# Altium schematic sheet leo_DM_BUCK.SchDoc
size A; SheetNumber: 3; SheetTotal: 6
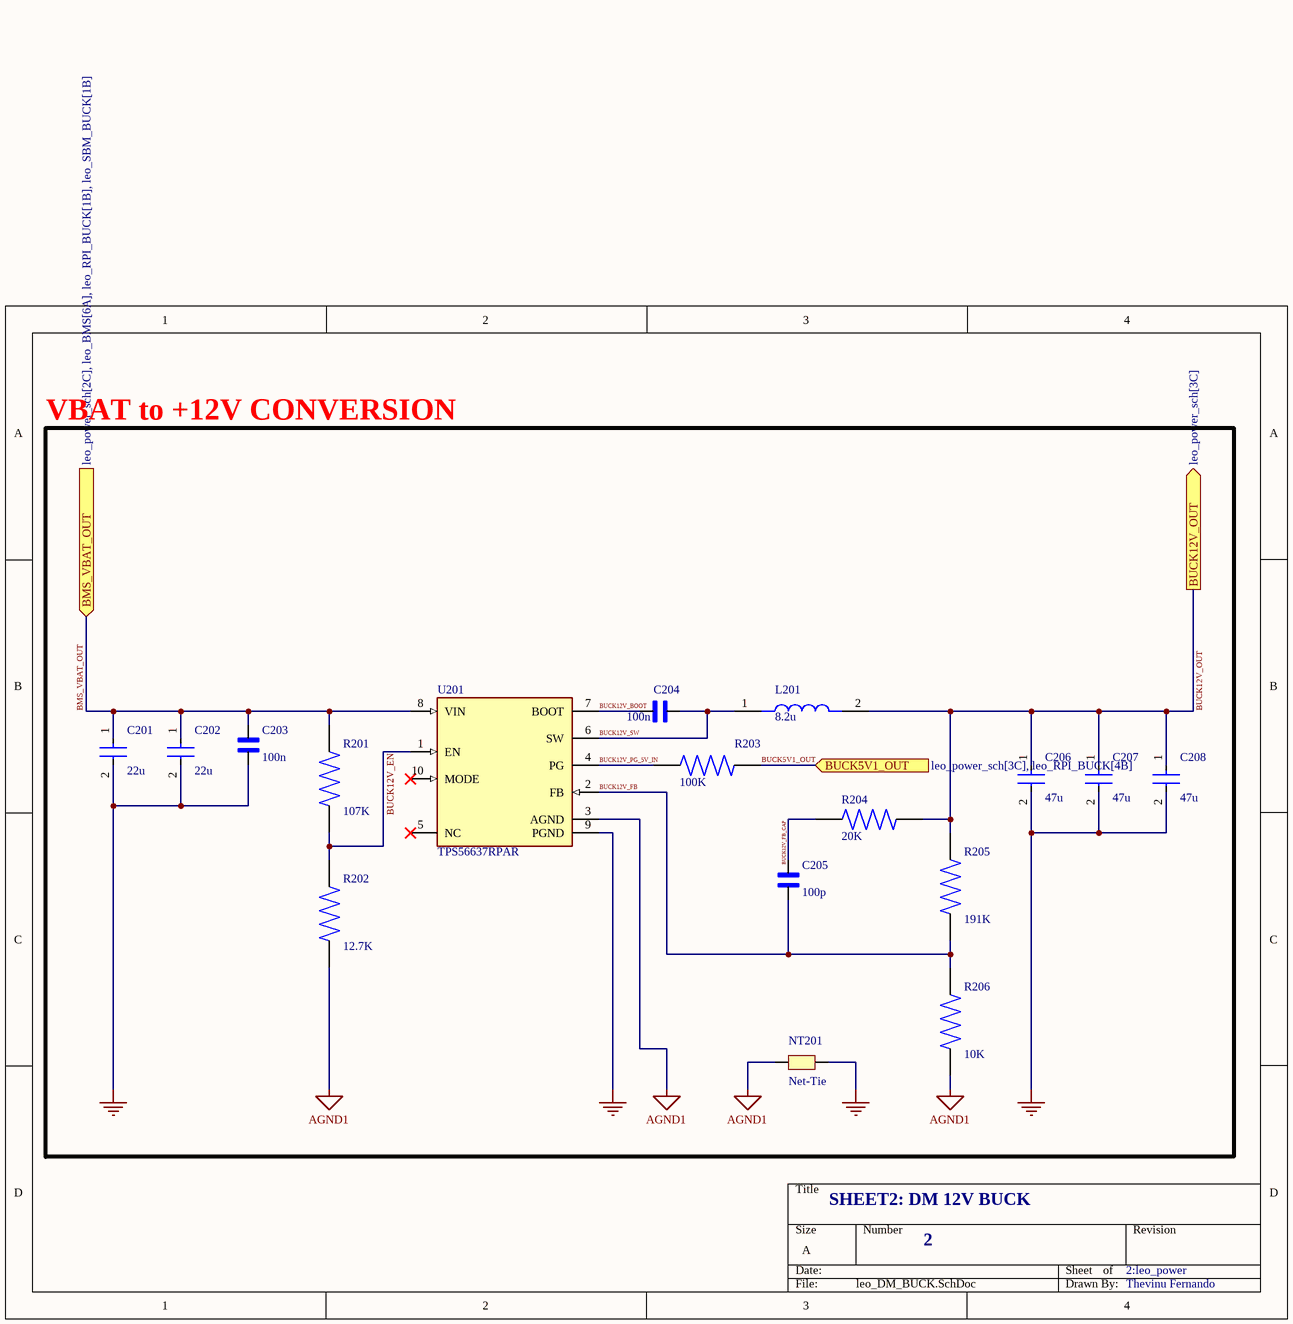
[diagram p0: leo_DM_BUCK.SchDoc]

## Parts
C201  22u  [CAP_1206]
C202  22u  [CAP_1206]
C203  100n  [CAP_0603]
C204  100n  [CAP_0402]
C205  100p  [CAP_0402]
C206  47u  [CAP_1206]
C207  47u  [CAP_1206]
C208  47u  [CAP_1206]
L201  8.2u  [IND_104CDMCCDS-8R2MC]
NT201  Net-Tie  [NET-TIE_SMD]  (net tie, no BOM)
R201  107K  [RES_0603]
R202  12.7K  [RES_0603]
R203  100K  [RES_0402]
R204  20K  [RES_0402]
R205  191K  [RES_0603]
R206  10K  [RES_0603]
U201  TPS56637RPAR  [FP-RPA0010A-MFG]

## Blocks framed on the sheet
VBAT to +12V CONVERSION: C201-C208 L201 NT201 R201-R206 U201

## Ports
BMS_VBAT_OUT (in, see leo_power_sch[2C], leo_BMS[6A], leo_RPI_BUCK[1B], leo_SBM_BUCK[1B]), BUCK5V1_OUT (in, see leo_power_sch[3C], leo_RPI_BUCK[4B]), BUCK12V_OUT (out, see leo_power_sch[3C])

## Nets
AGND1: NT201.2 R202.1 R206.1 U201.3(AGND)
GND: C201.2 C202.2 C203.1 C206.2 C207.2 C208.2 NT201.1 U201.9(PGND)
BMS_VBAT_OUT: C201.1 C202.1 C203.2 R201.2 U201.8(VIN) ; port BMS_VBAT_OUT
BUCK5V1_OUT: R203.1 ; port BUCK5V1_OUT
BUCK12V_BOOT: C204.1 U201.7(BOOT)
BUCK12V_EN: R201.1 R202.2 U201.1(EN)
BUCK12V_FB: C205.1 R205.1 R206.2 U201.2(FB)
BUCK12V_FB_CAP: C205.2 R204.2
BUCK12V_OUT: C206.1 C207.1 C208.1 L201.2 R204.1 R205.2 ; port BUCK12V_OUT
BUCK12V_PG_5V_IN: R203.2 U201.4(PG)
BUCK12V_SW: C204.2 L201.1 U201.6(SW)

Not connected (* = marked no-connect by the designer): U201 5(NC)* 10(MODE)*

## Notes on the sheet
- SHEET2: DM 12V BUCK
- 2
- 2:leo_power
- Thevinu Fernando

## Library data of the parts
C201 C202 C206-C208 = CAP_1206: Ceramic Capacitor, Multilayer, Ceramic, 25V, 10% +Tol, 10% -Tol, X5R, 15% TC, 22uF, Surface Mount, 1206; Part Number: CL31A226KAHNNNE; Manufacturer: Samsung; Symbol Hash: fb88589c83559698c54462c48d907c3ddae810bd717f4f20b193cecb944ab7ab; Verification Version: 0.0.0.3; Capacitance: 22µF; Mouser Part Number: 187-CL31A226KAHNNNE; Temperature Coefficient: 15%; Temperature Range High: +85°C; Digikey Description: CAP CER 22UF 25V X5R 1206; Digikey Part Number: 1276-3047-1-ND; Tolerance: 10%; ComponentLink2URL: https://product.samsungsem.com/mlcc/CL31A226KAHNNN.do; ComponentLink2Description: Datasheet; Voltage Rating: 25V; Lead Free: Yes; Height: 1.8mm; Temperature Characteristic: X5R; Automotive: No; Package: CL31H-0.2; Temperature Range Low: -55°C; Capacitance: 22uF; RoHS: TRUE; Material: Ceramic; Ipc Land Pattern Name: CAPC320160X160; ComponentLink1Description: Upverter; Supplier 2: Mouser; Supplier 1: Digi-Key; ComponentLink1URL: https://upverter.com/part/id/4e7a76ad8fe2f2e1/; Supplier Part Number 2: 187-CL31A226KAHNNNE; Supplier Part Number 1: 1276-3047-1-ND; Value: 22uF; helpURL: https://upverter.com/part/id/4e7a76ad8fe2f2e1/; Temperature: -55°C to +85°C; RoHS: Compliant; Dielectric: X5R; HelpURL: https://product.samsungsem.com/mlcc/CL31A226KAHNNN.do; Max Operating Temperature: 85°C; Voltage Rating (DC): 25V; ComponentLink2Description: Datasheet URL; Min Operating Temperature: -55°C; Case/Package: 1206
C203 = CAP_0603: Â±10% 50V Ceramic Capacitor X7R 0603 (1608 Metric); MF: Samsung Electro-Mechanics; MP: CL10B104KB8NNNC; SnapEDA_Link: https://www.snapeda.com/parts/CL10B104KB8NNNC/Samsung/view-part/?ref=snap; Package: SMD-2 Samsung; Value: *; Check_prices: https://www.snapeda.com/parts/CL10B104KB8NNNC/Samsung/view-part/?ref=eda
C204 C205 = CAP_0402: ±10% 50V Ceramic Capacitor X7R 0402; MF: Samsung; MP: CL05B104KO5NNNC; SnapEDA_Link: https://www.snapeda.com/parts/CL05B104KO5NNNC/Samsung/view-part/?ref=snap; Package: SMD-2-2 Samsung; Value: *; Check_prices: https://www.snapeda.com/parts/CL05B104KO5NNNC/Samsung/view-part/?ref=eda
L201 = 104CDMCCDS-8R2MC: Inductor Power Shielded/Molded Wirewound 8.2uH 20% 100KHz Metal 8.3A 0.027Ohm DCR 4040 T/R; MF: Sumida; Package: Nonstandard Sumida; Check_prices: https://www.snapeda.com/parts/104CDMCCDS-8R2MC/Sumida/view-part/?ref=eda; Value: *; Price: None; Purchase-URL: https://pricing.snapeda.com/search/part/104CDMCCDS-8R2MC/?ref=eda; MP: 104CDMCCDS-8R2MC; SnapEDA_Link: https://www.snapeda.com/parts/104CDMCCDS-8R2MC/Sumida/view-part/?ref=snap; Availability: In Stock
NT201 = NET-TIE: Single point connection between nets.; MountType: SMT; PackageReference: N/A; CompType: Net-Tie; Library Reference: Net-Tie; Manufacturer: N/A; PartNumber: N/A
R201 R202 R205 R206 = RES_0603: Â±1% 0.1W, 1/10W Chip Resistor 0603 (1608 Metric) Moisture Resistant Thick Film; MF: Yageo; MP: RC0603FR-0791KL; SnapEDA_Link: https://www.snapeda.com/parts/RC0603FR-0791KL/Yageo/view-part/?ref=snap; Package: 1608 Yageo; Value: *; Check_prices: https://www.snapeda.com/parts/RC0603FR-0791KL/Yageo/view-part/?ref=eda
R203 R204 = RES_0402: Chip Resistor 0402 (1005 Metric) Automotive AEC-Q200 Thick Film; MF: Panasonic; MP: ERJ-2RKF1002X; Package: 1005-2 Panasonic; Price: None; Check_prices: https://www.snapeda.com/parts/ERJ-2RKF1002X/Panasonic%20Electronic%20Components/view-part/78636/?ref=eda; Value: *; SnapEDA_Link: https://www.snapeda.com/parts/ERJ-2RKF1002X/Panasonic%20Electronic%20Components/view-part/78636/?ref=snap; Availability: In Stock
U201 = TPS56637RPAR: Buck Switching Regulator IC Adjustable 0.6V~13V 1 Output 6A VQFN-10-HR(3x3); Manufacturer: Texas Instruments; Max Duty Cycle: 91%; Nominal Supply Current: 140uA; Max Supply Voltage: 28V; Switching Frequency: 500kHz; Output Type: AdjustableProgrammable; Max Junction Temp: +150°C; Output Voltage: 0.6-13V; Standoff Height: 0mm; Number Of Outputs: 1; Min Supply Voltage: 4.5V; Automotive: No; Manufacturer Part Number: TPS56637RPAR; Lead Free: Yes; Temperature Range Low: -40°C; Digikey Description: IC POWER MANAGEMENT; Octopart: https://octopart.com/tps56637rpar-texas+instruments-97650653; Output Current: 6A; Temperature: -40°C to +150°C; Device Class L3: Voltage Regulators - Switching; Temperature Range High: +150°C; Package: RPA0010A; Device Class L2: Power Management ICs; ComponentLink2URL: http://www.ti.com/lit/ds/symlink/tps56637.pdf; Device Class L1: Integrated Circuits (ICs); Switching Topology: Buck; RoHS: TRUE; ComponentLink2Description: Datasheet; Height: 1mm; Category: IC